# Altium project DM1097_R1M1E1.PrjPcb (part 10 of 12)
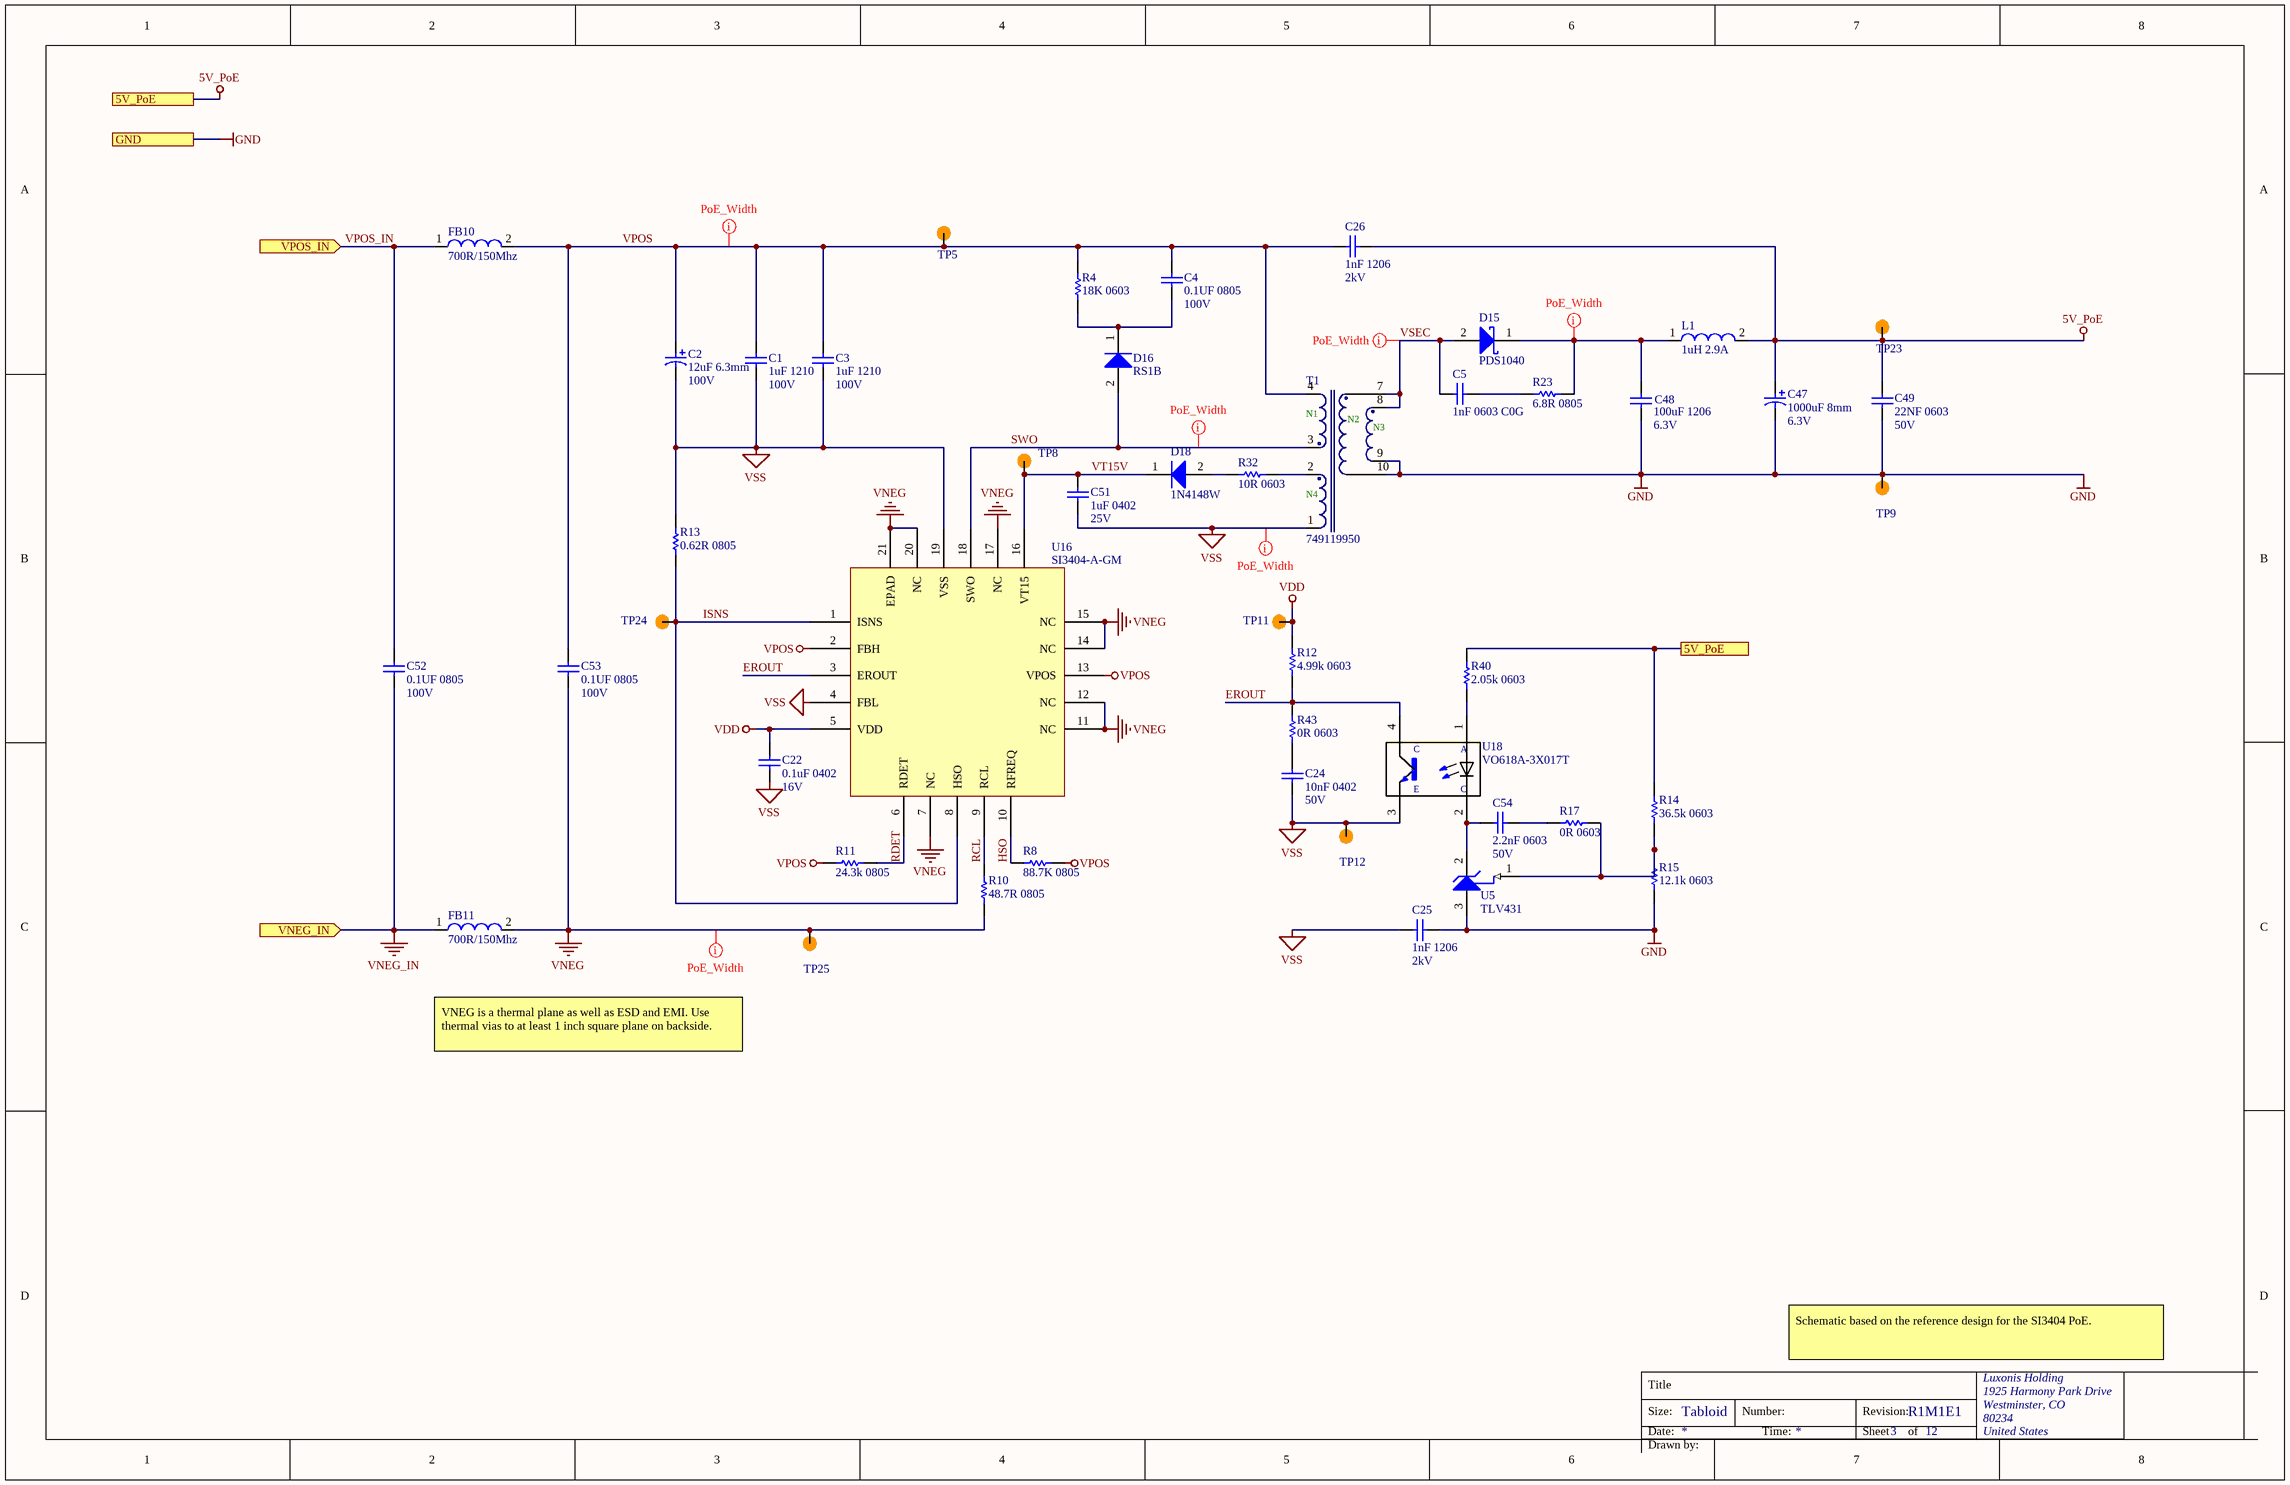
[diagram p118: DM1097_PoE.SchDoc]

## Sheet DM1097_PoE.SchDoc: =project_title (continued)

### Library data of the parts (continued)
R13 = RL0805FR-070R62L: RES SMD 620 MOHM 1% 1/8W 0805; Manufacturer 1: Yageo; Resistance: 620mR; Power Rating: 125mW; Temperature Coefficient: 200ppm/°C; Voltage Rating (DC): 300V; Supplier 1: Digi-Key; Manufacturer Part Number 1: RL0805FR-070R62L; Stock 1: 16217; Pricing 1: 1=0.33000, 10=0.28200, 100=0.11030, 1000=0.04619, 2500=0.04234 (USD); RoHS: Yes; Case/Package: 0805; Weight: 0.000194oz; Case Code (Metric): 2012; Case Code (Imperial): 0805; Contact Plating: Tin,Matte; Min Operating Temperature: -55°C; Max Operating Temperature: 125°C; Packaging: Tape and Reel; Tolerance: 1%; Package Quantity: 1; Composition: Thick Film; Termination: SMD/SMT; Number of Terminations: 2; Max Power Dissipation: 125mW; Features: Moisture Resistant; Length: 0.079inch; Height: 0.024inch; Width: 0.049inch; Radiation Hardening: No; Lead Free: Lead Free; ComponentLink1URL: https://datasheet.ciiva.com/15328/pyu-rl-521-rohs-l-5-15328303.pdf?src-supplier=Mouser; ComponentLink1Description: https://datasheet.ciiva.com/15328/pyu-rl-521-rohs-l-5-15328303.pdf?src-supplier=Mouser; Supplier 2: Mouser; Supplier 3: Future Electronics; Supplier Part Number 1: 311-.62SCT-ND; Supplier Part Number 2: 603-RL0805FR-070R62L; Supplier Part Number 3: RL0805FR-070R62L-CUTT
R14 = RC0603FR-0736K5L: RES SMD 36.5K OHM 1% 1/10W 0603; Manufacturer 1: Yageo; Resistance: 36.5kR; Power Rating: 100mW; Voltage Rating: 50V; Temperature Coefficient: 100ppm/°C; Working Voltage: 75V; Supplier 1: Digi-Key; Manufacturer Part Number 1: RC0603FR-0736K5L; Stock 1: 763857; Pricing 1: 1=0.10000, 10=0.02300, 100=0.00940, 1000=0.00421, 2500=0.00366 (USD); RoHS: Yes; Case/Package: 0603; Case Code (Metric): 1608; Case Code (Imperial): 0603; Min Operating Temperature: -55°C; Max Operating Temperature: 155°C; Package Quantity: 1; Tolerance: 1%; Packaging: Tape and Reel; Composition: Thick Film; Number of Terminations: 2; Termination: SMD/SMT; Military Standard: Not; Max Power Dissipation: 100mW; Voltage Rating (DC): 50V; Features: Moisture Resistant; Length: 0.063inch; Height: 0.022inch; Width: 0.031inch; Depth: 0.8mm; Lead Free: Lead Free; ComponentLink1URL: https://datasheet.ciiva.com/2491/pyu-r-int-thick-7-2491306.pdf?src-supplier=Digi-Key; ComponentLink1Description: https://datasheet.ciiva.com/2491/pyu-r-int-thick-7-2491306.pdf?src-supplier=Digi-Key; ComponentLink2URL: https://datasheet.ciiva.com/2491/pyu-r-int-thick-7-2491307.pdf?src-supplier=Digi-Key; ComponentLink2Description: https://datasheet.ciiva.com/2491/pyu-r-int-thick-7-2491307.pdf?src-supplier=Digi-Key; ComponentLink3URL: https://datasheet.ciiva.com/2491/pyu-r-int-thick-7-2491308.pdf?src-supplier=Digi-Key; ComponentLink3Description: https://datasheet.ciiva.com/2491/pyu-r-int-thick-7-2491308.pdf?src-supplier=Digi-Key; Supplier 2: Mouser; Supplier 3: Future Electronics; Supplier Part Number 1: 311-36.5KHRCT-ND; Supplier Part Number 2: 603-RC0603FR-0736K5L; Supplier Part Number 3: RC0603FR-0736K5L-CUTT
R15 = RC0603FR-0712K1L: RES SMD 12.1K OHM 1% 1/10W 0603; Manufacturer 1: Yageo; Power Rating: 100mW; Temperature Coefficient: 100ppm/°C; Resistance: 12.1kR; Voltage Rating: 50V; Supplier 1: Digi-Key; Manufacturer Part Number 1: RC0603FR-0712K1L; Stock 1: 267774; Pricing 1: 1=0.10000, 10=0.02300, 100=0.00940, 1000=0.00421, 2500=0.00366 (USD); RoHS: Yes; Case/Package: 0603; Number of Pins: 2; Case Code (Metric): 1608; Case Code (Imperial): 0603; Min Operating Temperature: -55°C; Max Operating Temperature: 155°C; Tolerance: 1%; Package Quantity: 1; Packaging: Tape and Reel; Composition: Thick Film; Number of Terminations: 2; Termination: SMD/SMT; Military Standard: Not; Max Power Dissipation: 100mW; Voltage Rating (DC): 50V; Features: Moisture Resistant; Length: 1.6mm; Height: 0.022inch; Depth: 0.8mm; Width: 0.031inch; REACH SVHC: No SVHC; Lead Free: Lead Free; ComponentLink1URL: https://datasheet.ciiva.com/2519/pyu-r-int-thick-7-2519216.pdf?src-supplier=Digi-Key; ComponentLink1Description: https://datasheet.ciiva.com/2519/pyu-r-int-thick-7-2519216.pdf?src-supplier=Digi-Key; ComponentLink2URL: https://datasheet.ciiva.com/2519/pyu-r-int-thick-7-2519217.pdf?src-supplier=Digi-Key; ComponentLink2Description: https://datasheet.ciiva.com/2519/pyu-r-int-thick-7-2519217.pdf?src-supplier=Digi-Key; ComponentLink3URL: https://datasheet.ciiva.com/2519/pyu-r-int-thick-7-2519218.pdf?src-supplier=Digi-Key; ComponentLink3Description: https://datasheet.ciiva.com/2519/pyu-r-int-thick-7-2519218.pdf?src-supplier=Digi-Key; ComponentLink4URL: https://datasheet.ciiva.com/15159/getdatasheetpartid-28802-15159207.pdf?src-supplier=Verical; ComponentLink4Description: https://datasheet.ciiva.com/15159/getdatasheetpartid-28802-15159207.pdf?src-supplier=Verical; ComponentLink5URL: https://datasheet.ciiva.com/12558/rc0603-272842-12558574.pdf?src-supplier=Mouser; ComponentLink5Description: https://datasheet.ciiva.com/12558/rc0603-272842-12558574.pdf?src-supplier=Mouser; ComponentLink6URL: https://datasheet.ciiva.com/46395/443971-46395022.pdf?src-supplier=Element14; ComponentLink6Description: https://datasheet.ciiva.com/46395/443971-46395022.pdf?src-supplier=Element14; Supplier 2: Newark; Supplier 3: Mouser; Supplier Part Number 3: 603-RC0603FR-0712K1L; Supplier Part Number 2: 66R2021; Supplier Part Number 1: 311-12.1KHRCT-ND
R17 R43 = CRCW06030000Z0EA: as R81 on sheet DM1097_LEFT_OV9282; Supplier 1: Digi-Key; Stock 1: 742743; Pricing 1: 1=0.100000, 10=0.034000, 25=0.024400, 50=0.018600, 100=0.013800, 250=0.010480, 500=0.008400, 1000=0.006180 (USD); RoHS: Yes; Mount: Surface Mount; Case/Package: 0603; Weight: 7.1E-05oz; Contact Plating: Tin,Lead; Case Code (Metric): 1608; Case Code (Imperial): 0603; Min Operating Temperature: -55°C; Max Operating Temperature: 155°C; Composition: Thick Film; Termination: SMD/SMT; Packaging: Tape and Reel; Package Quantity: 1; Number of Terminations: 2; Military Standard: Not; Max Power Dissipation: 100mW; Voltage Rating (DC): 75V; Features: Automotive AEC-Q200; Working Voltage: 75V; Length: 1.55mm; Height: 0.02inch; Width: 0.033inch; Depth: 0.85mm; Radiation Hardening: No; Lead Free: Lead Free; REACH SVHC: Unknown; ComponentLink1URL: https://datasheet.ciiva.com/2461/dcrcwe3-2461968.pdf?src-supplier=Digi-Key; ComponentLink1Description: https://datasheet.ciiva.com/2461/dcrcwe3-2461968.pdf?src-supplier=Digi-Key; ComponentLink2URL: https://datasheet.ciiva.com/2461/dcrcwe3-2461969.pdf?src-supplier=Digi-Key; ComponentLink2Description: https://datasheet.ciiva.com/2461/dcrcwe3-2461969.pdf?src-supplier=Digi-Key; ComponentLink3URL: https://datasheet.ciiva.com/2461/dcrcwe3-2461970.pdf?src-supplier=Digi-Key; ComponentLink3Description: https://datasheet.ciiva.com/2461/dcrcwe3-2461970.pdf?src-supplier=Digi-Key; ComponentLink4URL: https://datasheet.ciiva.com/8340/dcrcwe3-8340197.pdf?src-supplier=Avnet; ComponentLink4Description: https://datasheet.ciiva.com/8340/dcrcwe3-8340197.pdf?src-supplier=Avnet; ComponentLink5URL: https://datasheet.ciiva.com/16941/dcrcw-16941302.pdf?src-supplier=Avnet+Europe; ComponentLink5Description: https://datasheet.ciiva.com/16941/dcrcw-16941302.pdf?src-supplier=Avnet+Europe; ComponentLink6URL: https://datasheet.ciiva.com/16199/dcrcwe3-16199063.pdf?src-supplier=Future+Electronics; ComponentLink6Description: https://datasheet.ciiva.com/16199/dcrcwe3-16199063.pdf?src-supplier=Future+Electronics; ComponentLink7URL: https://datasheet.ciiva.com/16725/70201119-16725175.pdf?src-supplier=Allied+Electronics; ComponentLink7Description: https://datasheet.ciiva.com/16725/70201119-16725175.pdf?src-supplier=Allied+Electronics; ComponentLink8URL: https://datasheet.ciiva.com/26316/fld-crcw-e3-data-en-26316615.pdf?src-supplier=Distrelec; ComponentLink8Description: https://datasheet.ciiva.com/26316/fld-crcw-e3-data-en-26316615.pdf?src-supplier=Distrelec; ComponentLink9URL: https://datasheet.ciiva.com/5544/dcrcwe3-109170-5544344.pdf?src-supplier=Mouser; ComponentLink9Description: https://datasheet.ciiva.com/5544/dcrcwe3-109170-5544344.pdf?src-supplier=Mouser; ComponentLink10URL: https://datasheet.ciiva.com/7841/1720486-7841816.pdf?src-supplier=Element14; ComponentLink10Description: https://datasheet.ciiva.com/7841/1720486-7841816.pdf?src-supplier=Element14; ComponentLink11URL: https://datasheet.ciiva.com/7841/1720486-7841817.pdf?src-supplier=Element14; ComponentLink11Description: https://datasheet.ciiva.com/7841/1720486-7841817.pdf?src-supplier=Element14; ComponentLink12URL: https://datasheet.ciiva.com/7841/125364-7841818.pdf?src-supplier=Element14; ComponentLink12Description: https://datasheet.ciiva.com/7841/125364-7841818.pdf?src-supplier=Element14; ComponentLink13URL: https://datasheet.ciiva.com/16721/70201119-16721450.pdf?src-supplier=Allied+Electronics; ComponentLink13Description: https://datasheet.ciiva.com/16721/70201119-16721450.pdf?src-supplier=Allied+Electronics; Supplier Part Number 1: 541-0.0GCT-ND
R23 = RC0805FR-076R8L: RES SMD 6.8 OHM 1% 1/8W 0805; Manufacturer 1: Yageo; Voltage Rating: 150V; Power Rating: 125mW; Temperature Coefficient: 200ppm/°C; Supplier 1: Digi-Key; Manufacturer Part Number 1: RC0805FR-076R8L; Stock 1: 334321; Pricing 1: 1=0.10000, 10=0.07200, 100=0.02770, 1000=0.01219, 2500=0.01053 (USD); RoHS: Yes; Case/Package: 0805; Number of Pins: 2; Case Code (Metric): 2012; Case Code (Imperial): 0805; Min Operating Temperature: -55°C; Max Operating Temperature: 155°C; Packaging: Tape and Reel; Voltage Rating (DC): 150V; Resistance: 6.8R; Tolerance: 1%; Package Quantity: 1; Composition: Thick Film; Number of Terminations: 2; Termination: SMD/SMT; Max Power Dissipation: 125mW; Features: Moisture Resistant; Length: 0.079inch; Height: 0.024inch; Width: 0.049inch; Depth: 1.25mm; REACH SVHC: No SVHC; Lead Free: Lead Free; ComponentLink1URL: https://datasheet.ciiva.com/11819/0900766b8106beab-11819870.pdf?src-supplier=RSComponents; ComponentLink1Description: https://datasheet.ciiva.com/11819/0900766b8106beab-11819870.pdf?src-supplier=RSComponents; ComponentLink2URL: https://datasheet.ciiva.com/2520/pyu-r-int-thick-7-2520880.pdf?src-supplier=Digi-Key; ComponentLink2Description: https://datasheet.ciiva.com/2520/pyu-r-int-thick-7-2520880.pdf?src-supplier=Digi-Key; ComponentLink3URL: https://datasheet.ciiva.com/12667/rc0805-12667932.pdf?src-supplier=Mouser; ComponentLink3Description: https://datasheet.ciiva.com/12667/rc0805-12667932.pdf?src-supplier=Mouser; ComponentLink4URL: https://datasheet.ciiva.com/7941/444164-7941837.pdf?src-supplier=Element14; ComponentLink4Description: https://datasheet.ciiva.com/7941/444164-7941837.pdf?src-supplier=Element14; ComponentLink5URL: https://datasheet.ciiva.com/2520/pyu-r-int-thick-7-2520878.pdf?src-supplier=Digi-Key; ComponentLink5Description: https://datasheet.ciiva.com/2520/pyu-r-int-thick-7-2520878.pdf?src-supplier=Digi-Key; ComponentLink6URL: https://datasheet.ciiva.com/7941/444164-7941838.pdf?src-supplier=Element14; ComponentLink6Description: https://datasheet.ciiva.com/7941/444164-7941838.pdf?src-supplier=Element14; ComponentLink7URL: https://datasheet.ciiva.com/2520/pyu-r-int-thick-7-2520879.pdf?src-supplier=Digi-Key; ComponentLink7Description: https://datasheet.ciiva.com/2520/pyu-r-int-thick-7-2520879.pdf?src-supplier=Digi-Key; Supplier 2: Future Electronics; Supplier 3: Mouser; Supplier Part Number 2: RC0805FR-076R8L-CUTT; Supplier Part Number 3: 603-RC0805FR-076R8L; Supplier Part Number 1: 311-6.80CRCT-ND
R32 = CRCW060310R0FKEA: RES SMD 10 OHM 1% 1/10W 0603; Manufacturer 1: Vishay; Power Rating: 100mW; Temperature Coefficient: 100ppm/°C; Voltage Rating: 75V; Supplier 1: Digi-Key; Manufacturer Part Number 1: CRCW060310R0FKEA; Stock 1: 155545; Pricing 1: 1=0.10000, 10=0.03400, 100=0.01390, 1000=0.00623, 2500=0.00540 (USD); RoHS: Yes; Mount: Surface Mount; Case/Package: 0603; Number of Pins: 2; Weight: 7.1E-05oz; Contact Plating: Tin; Case Code (Metric): 1608; Case Code (Imperial): 0603; Min Operating Temperature: -55°C; Max Operating Temperature: 155°C; Resistance: 10R; Tolerance: 1%; Composition: Thick Film; Packaging: Tape and Reel; Package Quantity: 10; Number of Terminations: 2; Termination: SMD/SMT; Military Standard: Not; Max Power Dissipation: 100mW; Voltage Rating (DC): 75V; Features: Automotive AEC-Q200; Length: 1.55mm; Height: 0.45mm; Width: 0.033inch; Depth: 0.85mm; Lead Free: Lead Free; REACH SVHC: Unknown; ComponentLink1URL: https://datasheet.ciiva.com/11808/0900766b80d98afc-11808660.pdf?src-supplier=RSComponents; ComponentLink1Description: https://datasheet.ciiva.com/11808/0900766b80d98afc-11808660.pdf?src-supplier=RSComponents; ComponentLink2URL: https://datasheet.ciiva.com/3256/dcrcwe3-3256955.pdf?src-supplier=Avnet; ComponentLink2Description: https://datasheet.ciiva.com/3256/dcrcwe3-3256955.pdf?src-supplier=Avnet; ComponentLink3URL: https://datasheet.ciiva.com/5547/dcrcwe3-109170-5547342.pdf?src-supplier=Mouser; ComponentLink3Description: https://datasheet.ciiva.com/5547/dcrcwe3-109170-5547342.pdf?src-supplier=Mouser; ComponentLink4URL: https://datasheet.ciiva.com/22673/1697337-22673071.pdf?src-supplier=Element14; ComponentLink4Description: https://datasheet.ciiva.com/22673/1697337-22673071.pdf?src-supplier=Element14; ComponentLink5URL: https://datasheet.ciiva.com/2465/dcrcwe3-2465699.pdf?src-supplier=Digi-Key; ComponentLink5Description: https://datasheet.ciiva.com/2465/dcrcwe3-2465699.pdf?src-supplier=Digi-Key; ComponentLink6URL: https://datasheet.ciiva.com/2465/dcrcwe3-2465701.pdf?src-supplier=Digi-Key; ComponentLink6Description: https://datasheet.ciiva.com/2465/dcrcwe3-2465701.pdf?src-supplier=Digi-Key; ComponentLink7URL: https://datasheet.ciiva.com/26316/fld-crcw-e3-data-en-26316582.pdf?src-supplier=Distrelec; ComponentLink7Description: https://datasheet.ciiva.com/26316/fld-crcw-e3-data-en-26316582.pdf?src-supplier=Distrelec; ComponentLink8URL: https://datasheet.ciiva.com/16781/70201119-16781847.pdf?src-supplier=Allied+Electronics; ComponentLink8Description: https://datasheet.ciiva.com/16781/70201119-16781847.pdf?src-supplier=Allied+Electronics; ComponentLink9URL: https://datasheet.ciiva.com/2465/dcrcwe3-2465700.pdf?src-supplier=Digi-Key; ComponentLink9Description: https://datasheet.ciiva.com/2465/dcrcwe3-2465700.pdf?src-supplier=Digi-Key; ComponentLink10URL: https://datasheet.ciiva.com/16740/dcrcwe3-16740661.pdf?src-supplier=Future+Electronics; ComponentLink10Description: https://datasheet.ciiva.com/16740/dcrcwe3-16740661.pdf?src-supplier=Future+Electronics; Supplier 2: Mouser; Supplier 3: Newark; Supplier Part Number 1: 541-10.0HDKR-ND; Supplier Part Number 2: 71-CRCW0603-10-E3; Supplier Part Number 3: 61M5338
R40 = RC0603FR-072K05L: RES SMD 2.05K OHM 1% 1/10W 0603; Manufacturer 1: Yageo; Resistance: 2.05kR; Power Rating: 100mW; Voltage Rating: 50V; Temperature Coefficient: 100ppm/°C; Supplier 1: Digi-Key; Manufacturer Part Number 1: RC0603FR-072K05L; Stock 1: 238970; Pricing 1: 1=0.10000, 10=0.02300, 100=0.00940, 1000=0.00421, 2500=0.00366 (USD); RoHS: Yes; Mount: Surface Mount; Case/Package: 0603; Case Code (Metric): 1608; Case Code (Imperial): 0603; Min Operating Temperature: -55°C; Max Operating Temperature: 155°C; Tolerance: 1%; Package Quantity: 1; Packaging: Tape and Reel; Composition: Thick Film; Number of Terminations: 2; Termination: SMD/SMT; Military Standard: Not; Max Power Dissipation: 100mW; Voltage Rating (DC): 50V; Features: Moisture Resistant; Length: 1.6mm; Height: 0.45mm; Width: 0.031inch; Depth: 0.8mm; Lead Free: Lead Free; ComponentLink1URL: https://datasheet.ciiva.com/11819/0900766b80f96399-11819302.pdf?src-supplier=RSComponents; ComponentLink1Description: https://datasheet.ciiva.com/11819/0900766b80f96399-11819302.pdf?src-supplier=RSComponents; ComponentLink2URL: https://datasheet.ciiva.com/2454/pyu-r-int-thick-7-2454210.pdf?src-supplier=Digi-Key; ComponentLink2Description: https://datasheet.ciiva.com/2454/pyu-r-int-thick-7-2454210.pdf?src-supplier=Digi-Key; ComponentLink3URL: https://datasheet.ciiva.com/2454/pyu-r-int-thick-7-2454211.pdf?src-supplier=Digi-Key; ComponentLink3Description: https://datasheet.ciiva.com/2454/pyu-r-int-thick-7-2454211.pdf?src-supplier=Digi-Key; ComponentLink4URL: https://datasheet.ciiva.com/2454/pyu-r-int-thick-7-2454212.pdf?src-supplier=Digi-Key; ComponentLink4Description: https://datasheet.ciiva.com/2454/pyu-r-int-thick-7-2454212.pdf?src-supplier=Digi-Key; Supplier 2: Mouser; Supplier 3: Future Electronics; Supplier Part Number 1: 311-2.05KHRCT-ND; Supplier Part Number 2: 603-RC0603FR-072K05L; Supplier Part Number 3: RC0603FR-072K05L-CUTT
T1 = 749119950: TRANS FLYBACK POE 127UH SMD; Manufacturer 1: Wurth Electronics; Current Rating: 1.3A; Power Rating: 13W; Max Input Voltage: 57V; Min Input Voltage: 36V; Output Voltage: 5V; Frequency: 500kHz; ComponentLink2URL: http://www.we-online.de/katalog/media/pdf/749119950.pdf; ComponentLink2Description: Datasheet; ComponentLink1Description: Manufacturer URL; ComponentLink1URL: http://www.we-online.com; Supplier 1: Digi-Key; Manufacturer Part Number 1: 749119950; Stock 1: 148; Pricing 1: 1=5.64000, 10=5.44300, 50=5.14100, 100=4.83800 (USD); RoHS: Yes; Mount: Surface Mount; Case/Package: SMD/SMT; Min Operating Temperature: -40°C; Max Operating Temperature: 125°C; Package Quantity: 1; Packaging: Tape and Reel; Inductance: 127uH; Length: 13.5mm; Height: 12.5mm; Width: 17.75mm; Height - Seated (Max): 12.5mm; REACH SVHC: No SVHC; ComponentLink3URL: https://datasheet.ciiva.com/1378/749119950-1378246.pdf?src-supplier=Element14; ComponentLink3Description: https://datasheet.ciiva.com/1378/749119950-1378246.pdf?src-supplier=Element14; ComponentLink4URL: https://datasheet.ciiva.com/5309/749119950-91646-5309801.pdf?src-supplier=Mouser; ComponentLink4Description: https://datasheet.ciiva.com/5309/749119950-91646-5309801.pdf?src-supplier=Mouser; ComponentLink5URL: https://datasheet.ciiva.com/1386/749119950-1386647.pdf?src-supplier=Farnell; ComponentLink5Description: https://datasheet.ciiva.com/1386/749119950-1386647.pdf?src-supplier=Farnell; ComponentLink6URL: https://datasheet.ciiva.com/2940/749119950-2940138.pdf?src-supplier=Digi-Key; ComponentLink6Description: https://datasheet.ciiva.com/2940/749119950-2940138.pdf?src-supplier=Digi-Key; ComponentLink7URL: https://datasheet.ciiva.com/2940/749119950-2940139.pdf?src-supplier=Digi-Key; ComponentLink7Description: https://datasheet.ciiva.com/2940/749119950-2940139.pdf?src-supplier=Digi-Key; Supplier 2: Digi-Key; Supplier 3: Mouser; Supplier Part Number 1: 732-2432-1-ND; Supplier Part Number 2: 732-2432-6-ND; Supplier Part Number 3: 710-749119950
TP5 TP8 TP9 TP11 TP12 TP23-TP25 = TEST_POINT
U5 = TLV431BCDBZR: IC VREF SHUNT ADJ SOT23-3; Manufacturer 1: Texas Instruments; Tolerance: 0.5%; Max Input Voltage: 7V; Output Voltage: 6V; Max Output Current: 15mA; Temperature Coefficient: 129ppm/°C; Cathode Current: 100uA; Reference Type: Shunt,Adjustable; Number of Channels: 1; Min Input Voltage: 1.24V; Supplier 1: Digi-Key; Manufacturer Part Number 1: TLV431BCDBZR; Stock 1: 3209; Pricing 1: 1=0.92000, 10=0.81200, 100=0.57850, 500=0.46772, 1000=0.35695 (USD); RoHS: Yes; Case/Package: SOT-23; Number of Pins: 3; Min Operating Temperature: -40°C; Max Operating Temperature: 125°C; Packaging: Tape and Reel; Package Quantity: 1; Output Current: 15mA; Max Output Voltage: 6V; Reference Voltage: 6V; Radiation Hardening: No; Lead Free: Lead Free; REACH SVHC: No SVHC; ComponentLink1URL: https://datasheet.ciiva.com/26889/tlv431bcdbzr-26889546.pdf?src-supplier=IIIC; ComponentLink1Description: https://datasheet.ciiva.com/26889/tlv431bcdbzr-26889546.pdf?src-supplier=IIIC; ComponentLink2URL: https://datasheet.ciiva.com/2006/tlv431a-2006546.pdf?src-supplier=Digi-Key; ComponentLink2Description: https://datasheet.ciiva.com/2006/tlv431a-2006546.pdf?src-supplier=Digi-Key; ComponentLink3URL: https://datasheet.ciiva.com/2006/tlv431a-2006547.pdf?src-supplier=Digi-Key; ComponentLink3Description: https://datasheet.ciiva.com/2006/tlv431a-2006547.pdf?src-supplier=Digi-Key; ComponentLink4URL: https://datasheet.ciiva.com/2006/tlv431a-2006548.pdf?src-supplier=Digi-Key; ComponentLink4Description: https://datasheet.ciiva.com/2006/tlv431a-2006548.pdf?src-supplier=Digi-Key; ComponentLink5URL: https://datasheet.ciiva.com/26264/tlv431b-26264234.pdf?src-supplier=Avnet+Europe; ComponentLink5Description: https://datasheet.ciiva.com/26264/tlv431b-26264234.pdf?src-supplier=Avnet+Europe; ComponentLink6URL: https://datasheet.ciiva.com/46397/1887487-46397709.pdf?src-supplier=Element14; ComponentLink6Description: https://datasheet.ciiva.com/46397/1887487-46397709.pdf?src-supplier=Element14; Supplier 2: TI store; Supplier 3: Mouser; Supplier Part Number 1: 296-17569-1-ND; Supplier Part Number 2: TLV431BCDBZR; Supplier Part Number 3: 595-TLV431BCDBZR
U16 = SI3404-A-GM: IC POE CNTRL 1 CHANNEL 20QFN; Manufacturer 1: Silicon Labs; Supplier 1: Digi-Key; Manufacturer Part Number 1: SI3404-A-GM; Stock 1: 1481; Pricing 1: 1=1.46000, 25=1.41040, 100=1.35600, 1000=1.33340 (USD); RoHS: No; ComponentLink1URL: https://www.silabs.com/documents/public/data-sheets/si3404-datasheet.pdf?src-supplier=Digi-Key; ComponentLink1Description: https://www.silabs.com/documents/public/data-sheets/si3404-datasheet.pdf?src-supplier=Digi-Key; Supplier 2: Mouser; Supplier Part Number 1: 336-4270-ND; Supplier Part Number 2: 634-SI3404-A-GM
U18 = VO618A-3X017T: OPTOISOLATOR 5.3KV TRANS 4-SMD; Manufacturer 1: Vishay Semiconductors; Max Power Dissipation: 150mW; Collector Emitter Voltage (VCEO): 80V; Collector Emitter Saturation Voltage: 400mV; Max Collector Current: 50mA; Max Input Current: 60mA; Number of Channels: 1; Reverse Breakdown Voltage: 6V; Forward Voltage: 1.1V; Current Transfer Ratio: 100%; Supplier 1: Digi-Key; Manufacturer Part Number 1: VO618A-3X017T; Stock 1: 28306; Pricing 1: 1=1.04000, 10=0.80900, 100=0.51980, 500=0.43890 (USD); RoHS: Yes; Mount: Surface Mount; Case/Package: SMD/SMT; Number of Pins: 4; Contact Plating: Tin; Min Operating Temperature: -55°C; Max Operating Temperature: 110°C; Packaging: Tape and Reel; Package Quantity: 1; Forward Current: 60mA; Max Output Voltage: 80V; Output Current per Channel: 50mA; Isolation Voltage: 5.3kV; Number of Elements: 1; Power Dissipation: 150mW; Input Current: 60mA; Radiation Hardening: No; REACH SVHC: Unknown; Lead Free: Lead Free; ComponentLink1URL: https://datasheet.ciiva.com/26183/vo618a-26183397.pdf?src-supplier=Avnet+Europe; ComponentLink1Description: https://datasheet.ciiva.com/26183/vo618a-26183397.pdf?src-supplier=Avnet+Europe; ComponentLink2URL: https://datasheet.ciiva.com/2087/vo618a-2087431.pdf?src-supplier=Digi-Key; ComponentLink2Description: https://datasheet.ciiva.com/2087/vo618a-2087431.pdf?src-supplier=Digi-Key; ComponentLink3URL: https://datasheet.ciiva.com/2087/vo618a-2087432.pdf?src-supplier=Digi-Key; ComponentLink3Description: https://datasheet.ciiva.com/2087/vo618a-2087432.pdf?src-supplier=Digi-Key; ComponentLink4URL: https://datasheet.ciiva.com/2087/vo618a-2087433.pdf?src-supplier=Digi-Key; ComponentLink4Description: https://datasheet.ciiva.com/2087/vo618a-2087433.pdf?src-supplier=Digi-Key; Supplier 2: Newark; Supplier 3: Mouser; Supplier Part Number 1: VO618A-3X017TCT-ND; Supplier Part Number 2: 48W3695; Supplier Part Number 3: 78-VO618A-3X017T

## Sheet DM1097_Connector_B.SchDoc: =project_title
size Tabloid; CompanyName: Luxonis Holding; DrawnBy: David Malovrh; Organization: Luxonis Holding; Address1: 1925 Harmony Park Drive; Address2: Westminster, CO; Address3: 80234; Address4: United States; DocumentNumber: D0000200; Revision: R1M1E1; SheetNumber: 3; SheetTotal: 17
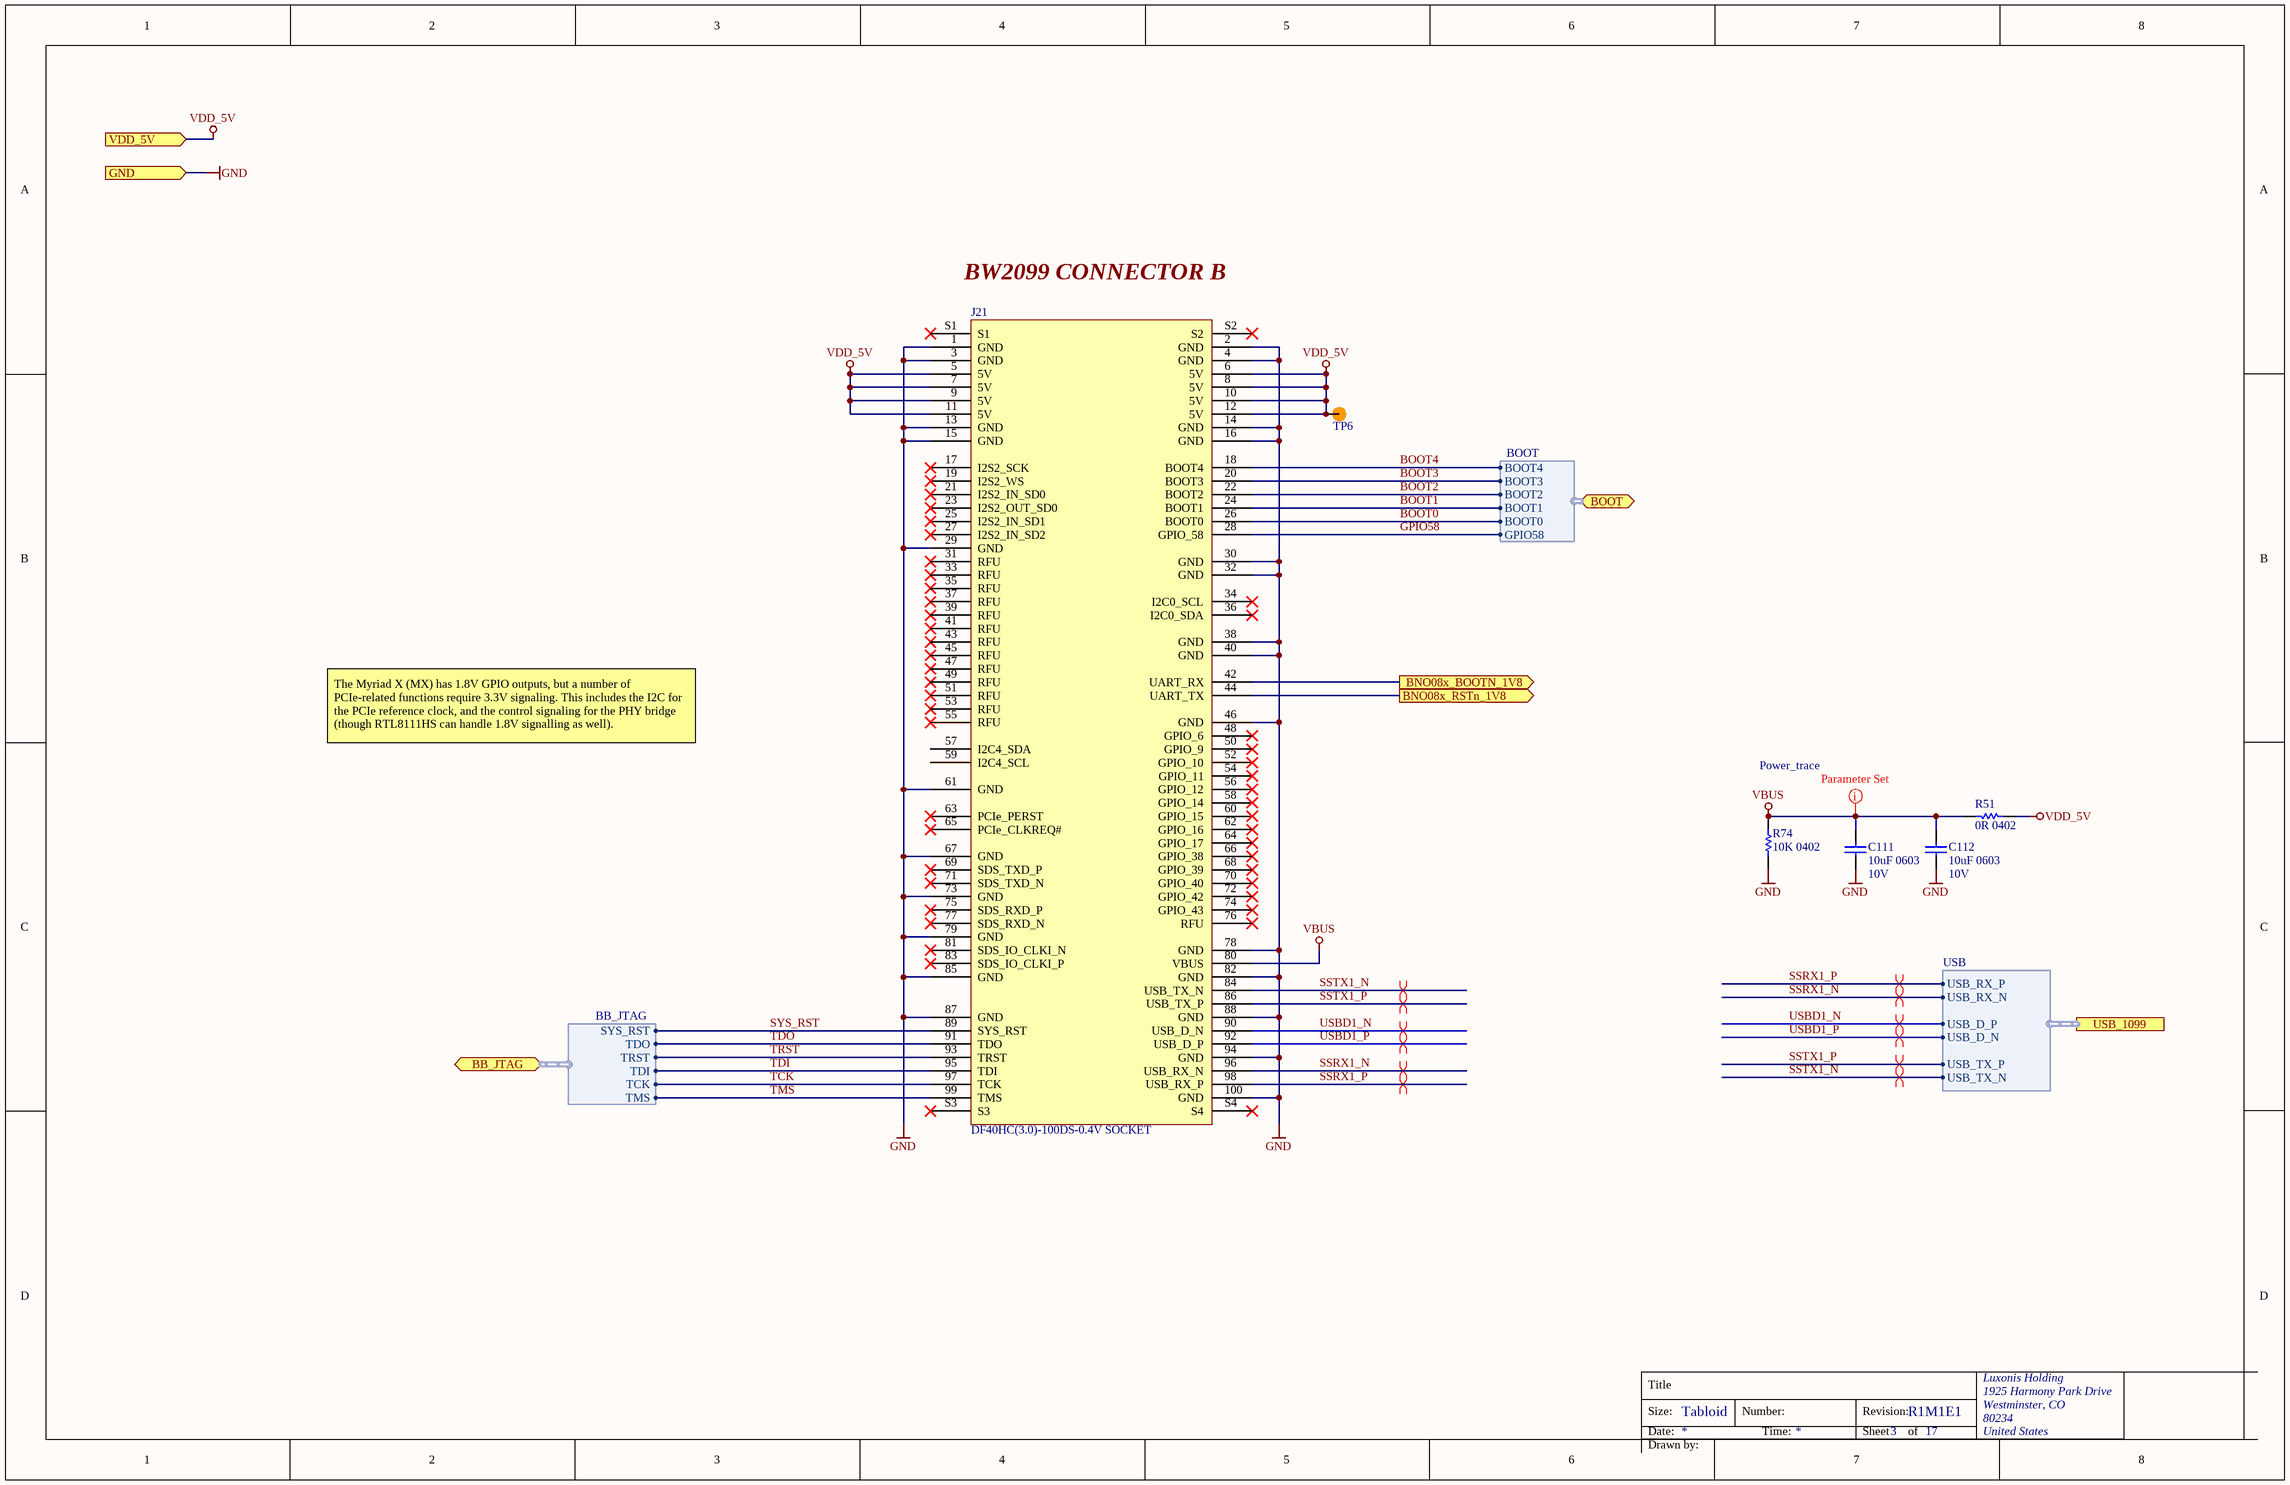
[diagram p14: DM1097_Connector_B.SchDoc]

### Parts
C111  10uF 0603  Voltage Rating: 10V  [CAPC0603(1608)100_N]
C112  10uF 0603  Voltage Rating: 10V  [CAPC0603(1608)100_N]
J21  DF40HC(3.0)-100DS-0.4V SOCKET  [DF40HC-3.0-100DS-0.4V_minpad]
R51  0R 0402  [RESC0402(1005)_N]
R74  10K 0402  [RESC0402(1005)_N]
TP6  TP100_200_NS  [TP100_200_NS]  (value not drawn)  (no BOM)

### Ports
BB_JTAG (bidir, harness BB_JTAG), BNO08x_BOOTN_1V8 (out), BNO08x_RSTn_1V8 (out), BOOT (bidir, harness BOOT), GND (in), USB_1099 (harness USB), VDD_5V (in)

### Harnesses
BB_JTAG: SYS_RST, TDO, TRST, TDI, TCK, TMS
BOOT: BOOT4, BOOT3, BOOT2, BOOT1, BOOT0, GPIO58
USB: USB_D_P, USB_D_N, USB_TX_N, USB_TX_P, USB_RX_N, USB_RX_P

### Nets
GND: C111.1 C112.1 J21.1(GND) J21.2(GND) J21.3(GND) J21.4(GND) J21.13(GND) J21.14(GND) J21.15(GND) J21.16(GND) J21.29(GND) J21.30(GND) J21.32(GND) J21.38(GND) J21.40(GND) J21.46(GND) J21.61(GND) J21.67(GND) J21.73(GND) J21.78(GND) J21.79(GND) J21.82(GND) J21.85(GND) J21.87(GND) J21.88(GND) J21.94(GND) J21.100(GND) R74.1 ; port GND
VBUS: C111.2 C112.2 J21.80(VBUS) R51.1 R74.2
VDD_5V: J21.5(5V) J21.6(5V) J21.7(5V) J21.8(5V) J21.9(5V) J21.10(5V) J21.11(5V) J21.12(5V) R51.2 TP6.1 ; port VDD_5V
BNO08x_RSTn_1V8: J21.44(UART_TX) ; port BNO08x_RSTn_1V8
BOOT0: J21.26(BOOT0) ; port BOOT.BOOT0
BOOT1: J21.24(BOOT1) ; port BOOT.BOOT1
BOOT2: J21.22(BOOT2) ; port BOOT.BOOT2
BOOT3: J21.20(BOOT3) ; port BOOT.BOOT3
BOOT4: J21.18(BOOT4) ; port BOOT.BOOT4
GPIO58: J21.28(GPIO_58) ; port BOOT.GPIO58
SSRX1_N: J21.96(USB_RX_N) ; port USB_1099.USB_RX_N
SSRX1_P: J21.98(USB_RX_P) ; port USB_1099.USB_RX_P
SSTX1_N: J21.84(USB_TX_N) ; port USB_1099.USB_TX_N
SSTX1_P: J21.86(USB_TX_P) ; port USB_1099.USB_TX_P
SYS_RST: J21.89(SYS_RST) ; port BB_JTAG.SYS_RST
TCK: J21.97(TCK) ; port BB_JTAG.TCK
TDI: J21.95(TDI) ; port BB_JTAG.TDI
TDO: J21.91(TDO) ; port BB_JTAG.TDO
TMS: J21.99(TMS) ; port BB_JTAG.TMS
TRST: J21.93(TRST) ; port BB_JTAG.TRST
USBD1_N: J21.90(USB_D_N) ; port USB_1099.USB_D_P
USBD1_P: J21.92(USB_D_P) ; port USB_1099.USB_D_N
NetJ21_42: J21.42(UART_RX) ; port BNO08x_BOOTN_1V8

Not connected (* = marked no-connect by the designer): J21 17(I2S2_SCK)* 19(I2S2_WS)* 21(I2S2_IN_SD0)* 23(I2S2_OUT_SD0)* 25(I2S2_IN_SD1)* 27(I2S2_IN_SD2)* 31(RFU)* 33(RFU)* 34(I2C0_SCL)* 35(RFU)* 36(I2C0_SDA)* 37(RFU)* 39(RFU)* 41(RFU)* 43(RFU)* 45(RFU)* 47(RFU)* 48(GPIO_6)* 49(RFU)* 50(GPIO_9)* 51(RFU)* 52(GPIO_10)* 53(RFU)* 54(GPIO_11)* 55(RFU)* 56(GPIO_12)* 57(I2C4_SDA) 58(GPIO_14)* 59(I2C4_SCL) 60(GPIO_15)* 62(GPIO_16)* 63(PCIe_PERST)* 64(GPIO_17)* 65(PCIe_CLKREQ#)* 66(GPIO_38)* 68(GPIO_39)* 69(SDS_TXD_P)* 70(GPIO_40)* 71(SDS_TXD_N)* 72(GPIO_42)* 74(GPIO_43)* 75(SDS_RXD_P)* 76(RFU)* 77(SDS_RXD_N)* 81(SDS_IO_CLKI_N)* 83(SDS_IO_CLKI_P)* S1* S2* S3* S4*

### Layout directives
differential pair; differential pair class 90ohm: SSRX1_N, SSRX1_P, SSTX1_N, SSTX1_P, USBD1_N, USBD1_P
net class Power_trace: VBUS

### Notes on the sheet
- (near J21) BW2099 CONNECTOR B
- The Myriad X (MX) has 1.8V GPIO outputs, but a number of PCIe-related functions require 3.3V signaling. This includes the I2C for the PCIe reference clock, and the control signaling for the PHY bridge (though RTL8111HS can handle 1.8V signalling as well).
- Title
- Size:
- Date:
- Tabloid
- Number:
- Time:
- Revision:
- Sheet
- of
- Drawn by:

### Library data of the parts
C111 C112 = GRM188R61A106ME69D: as C31 on sheet DM1097_LEFT_OV9282; Manufacturer Part Number 1: GRM188R61A106ME69D; Supplier 1: Digi-Key; Stock 1: 2873098; Pricing 1: 1=0.21000, 10=0.14100, 100=0.07130, 500=0.04876, 1000=0.04313 (USD); RoHS: Yes; Mount: Surface Mount; Case/Package: 0603; Case Code (Metric): 1608; Case Code (Imperial): 0603; Min Operating Temperature: -55°C; Max Operating Temperature: 85°C; Packaging: Tape and Reel; Capacitance: 10uF; Dielectric: X5R; Length: 1.6mm; Width: 0.8mm; ComponentLink1URL: http://www.mouser.com/ds/2/281/c02e-2905.pdf?src-supplier=Mouser; ComponentLink1Description: http://www.mouser.com/ds/2/281/c02e-2905.pdf?src-supplier=Mouser; Supplier Part Number 1: 490-10475-1-ND; Voltage Rating (DC): 10V; Thickness: 0.035inch; Tolerance: 20%; Weight: 0.000222oz; Package Quantity: 4000; Termination: SMD/SMT; Height: 0.8mm; Depth: 0.8mm; REACH SVHC: Unknown; Lead Free: Lead Free; ComponentLink2URL: http://components.arrow.com/part/dataview/0323_06119472?src-supplier=Arrow+Europe; ComponentLink2Description: http://components.arrow.com/part/dataview/0323_06119472?src-supplier=Arrow+Europe; ComponentLink3URL: http://www.farnell.com/datasheets/2048014.pdf?src-supplier=Farnell; ComponentLink3Description: http://www.farnell.com/datasheets/2048014.pdf?src-supplier=Farnell; ComponentLink4URL: http://www.farnell.com/datasheets/1872210.pdf?src-supplier=Farnell; ComponentLink4Description: http://www.farnell.com/datasheets/1872210.pdf?src-supplier=Farnell; ComponentLink5URL: http://search.murata.co.jp/Ceramy/image/img/A01X/G101/ENG/GRM188R61A106ME69-01.pdf?src-supplier=Digi-Key; ComponentLink5Description: http://search.murata.co.jp/Ceramy/image/img/A01X/G101/ENG/GRM188R61A106ME69-01.pdf?src-supplier=Digi-Key; ComponentLink6URL: http://www.farnell.com/datasheets/1872210.pdf?src-supplier=Newark; ComponentLink6Description: http://www.farnell.com/datasheets/1872210.pdf?src-supplier=Newark; ComponentLink7URL: http://www.farnell.com/datasheets/2048014.pdf?src-supplier=Element14; ComponentLink7Description: http://www.farnell.com/datasheets/2048014.pdf?src-supplier=Element14; ComponentLink8URL: http://www.farnell.com/datasheets/2048014.pdf?src-supplier=Newark; ComponentLink8Description: http://www.farnell.com/datasheets/2048014.pdf?src-supplier=Newark
J21 = BW2099_SCKT_Conn_B: Conn Board to Board RCP 100 POS 0.4mm Solder ST SMD T/R; Manufacturer 1: Hirose; Manufacturer Part Number 1: DF40HC(3.0)-100DS-0.4V(51; Connector Type: Receptacle; Number of Positions: 100; Pitch: 0.016inch; Supplier 1: Mouser; RoHS: Yes; Category: Headers and Wire Housings; Stock 1: 4724; Pricing 1: 1=2.50000, 10=2.15000, 50=2.15000, 100=2.00000, 1000=1.45000, 10000=1.29000 (USD); Mount: Surface Mount; Contact Plating: Gold; Package Quantity: 3000; Packaging: Tape and Reel; Number of Rows: 2; ComponentLink1URL: https://datasheet.ciiva.com/13559/ed-df40-20140305-13559540.pdf?src-supplier=Mouser; ComponentLink1Description: https://datasheet.ciiva.com/13559/ed-df40-20140305-13559540.pdf?src-supplier=Mouser; ComponentLink2URL: https://datasheet.ciiva.com/18562/ed-df40-20140305-18562462.pdf?src-supplier=Digi-Key; ComponentLink2Description: https://datasheet.ciiva.com/18562/ed-df40-20140305-18562462.pdf?src-supplier=Digi-Key
R51 = CRCW04020000Z0ED: as R62 on sheet DM1097_Power_Supply; Manufacturer Part Number 1: CRCW04020000Z0ED; Supplier 1: Digi-Key; Stock 1: 855968; Pricing 1: 1=0.10000, 10=0.03400, 25=0.02440, 50=0.01860, 100=0.01380, 250=0.01048, 500=0.00840, 1000=0.00618, 5000=0.00443 (USD); RoHS: Yes; Mount: Surface Mount; Case/Package: 0402; Weight: 2.3E-05oz; Case Code (Imperial): 0402; Case Code (Metric): 1005; Contact Plating: Tin; Min Operating Temperature: -55°C; Max Operating Temperature: 155°C; Packaging: Tape and Reel; Composition: Thick Film; Voltage Rating (DC): 50V; Package Quantity: 1; Termination: SMD/SMT; Number of Terminations: 2; Military Standard: Not; Max Power Dissipation: 63mW; Features: Automotive AEC-Q200; Length: 1mm; Height: 0.35mm; Width: 0.5mm; Depth: 0.5mm; Radiation Hardening: No; REACH SVHC: Unknown; Lead Free: Lead Free; ComponentLink1URL: https://datasheet.ciiva.com/3255/dcrcwe3-3255944.pdf?src-supplier=Avnet; ComponentLink1Description: https://datasheet.ciiva.com/3255/dcrcwe3-3255944.pdf?src-supplier=Avnet; ComponentLink2URL: https://datasheet.ciiva.com/3255/dcrcwe3-3255945.pdf?src-supplier=Avnet; ComponentLink2Description: https://datasheet.ciiva.com/3255/dcrcwe3-3255945.pdf?src-supplier=Avnet; ComponentLink3URL: https://datasheet.ciiva.com/16881/dcrcwe3-16881413.pdf?src-supplier=Avnet+Europe; ComponentLink3Description: https://datasheet.ciiva.com/16881/dcrcwe3-16881413.pdf?src-supplier=Avnet+Europe; ComponentLink4URL: https://datasheet.ciiva.com/2461/dcrcwe3-2461962.pdf?src-supplier=Digi-Key; ComponentLink4Description: https://datasheet.ciiva.com/2461/dcrcwe3-2461962.pdf?src-supplier=Digi-Key; ComponentLink5URL: https://datasheet.ciiva.com/7841/1720486-7841802.pdf?src-supplier=Element14; ComponentLink5Description: https://datasheet.ciiva.com/7841/1720486-7841802.pdf?src-supplier=Element14; ComponentLink6URL: https://datasheet.ciiva.com/2461/dcrcwe3-2461963.pdf?src-supplier=Digi-Key; ComponentLink6Description: https://datasheet.ciiva.com/2461/dcrcwe3-2461963.pdf?src-supplier=Digi-Key; ComponentLink7URL: https://datasheet.ciiva.com/2461/dcrcwe3-2461964.pdf?src-supplier=Digi-Key; ComponentLink7Description: https://datasheet.ciiva.com/2461/dcrcwe3-2461964.pdf?src-supplier=Digi-Key; ComponentLink8URL: https://datasheet.ciiva.com/7841/1697337-7841468.pdf?src-supplier=Element14; ComponentLink8Description: https://datasheet.ciiva.com/7841/1697337-7841468.pdf?src-supplier=Element14; ComponentLink9URL: https://datasheet.ciiva.com/16761/70200976-16761309.pdf?src-supplier=Allied+Electronics; ComponentLink9Description: https://datasheet.ciiva.com/16761/70200976-16761309.pdf?src-supplier=Allied+Electronics; ComponentLink10URL: https://datasheet.ciiva.com/26311/fld-crcw-e3-data-en-26311550.pdf?src-supplier=Distrelec; ComponentLink10Description: https://datasheet.ciiva.com/26311/fld-crcw-e3-data-en-26311550.pdf?src-supplier=Distrelec; Supplier Part Number 1: 541-0.0JCT-ND
R74 = RC0402FR-1310KL: as R33 on sheet DM1097_LEFT_OV9282; Manufacturer Part Number 1: RC0402FR-1310KL; ComponentLink1URL: https://datasheet.ciiva.com/16940/pyu-rc0402-51-rohs-l-6-16940293.pdf?src-supplier=Avnet+Europe; ComponentLink1Description: https://datasheet.ciiva.com/16940/pyu-rc0402-51-rohs-l-6-16940293.pdf?src-supplier=Avnet+Europe; ComponentLink2URL: https://datasheet.ciiva.com/28386/pyu-rc0402-51-rohs-l-6-28386855.pdf?src-supplier=Avnet+Europe; ComponentLink2Description: https://datasheet.ciiva.com/28386/pyu-rc0402-51-rohs-l-6-28386855.pdf?src-supplier=Avnet+Europe; ComponentLink3URL: https://datasheet.ciiva.com/16740/pyu-rc0402-51-rohs-l-6-r-16740602.pdf?src-supplier=Future+Electronics; ComponentLink3Description: https://datasheet.ciiva.com/16740/pyu-rc0402-51-rohs-l-6-r-16740602.pdf?src-supplier=Future+Electronics; ComponentLink4URL: https://datasheet.ciiva.com/8891/pyu-rc0402-51-rohs-l-6-8891339.pdf?src-supplier=Avnet; ComponentLink4Description: https://datasheet.ciiva.com/8891/pyu-rc0402-51-rohs-l-6-8891339.pdf?src-supplier=Avnet; ComponentLink5URL: https://datasheet.ciiva.com/5557/pyu-rc0402-51-rohs-l-6-r-5557997.pdf?src-supplier=Mouser; ComponentLink5Description: https://datasheet.ciiva.com/5557/pyu-rc0402-51-rohs-l-6-r-5557997.pdf?src-supplier=Mouser; ComponentLink6URL: https://datasheet.ciiva.com/7983/1018594-7983533.pdf?src-supplier=Element14; ComponentLink6Description: https://datasheet.ciiva.com/7983/1018594-7983533.pdf?src-supplier=Element14; Supplier 1: Newark; Stock 1: 62239; Pricing 1: 1=0.10000, 25=0.01200, 100=0.00400, 250=0.00400, 500=0.00300, 1000=0.00300 (USD); RoHS: Yes; Case/Package: 0402; Number of Pins: 2; Contact Plating: Tin,Matte,Lead; Case Code (Imperial): 0402; Case Code (Metric): 1005; Min Operating Temperature: -55°C; Max Operating Temperature: 155°C; Tolerance: 1%; Composition: Thick Film; Packaging: Tape and Reel; Termination: SMD/SMT; Military Standard: Not; Voltage Rating (DC): 50V; Working Voltage: 50V; Number of Terminations: 2; Length: 1mm; Depth: 0.5mm; Radiation Hardening: No; REACH SVHC: No SVHC; Lead Free: Lead Free; Supplier Part Number 1: 67R9960; Supplier 2: Future Electronics; Supplier 3: Mouser; Supplier 4: Element14; Supplier Part Number 2: RC0402FR-1310KL-CUTT; Supplier Part Number 3: 603-RC0402FR-1310KL; Supplier Part Number 4: 1799235
TP6 = TEST_POINT